# Altium schematic sheet SPI Stuff.SchDoc
size A4; SheetNumber: 5; SheetTotal: 6
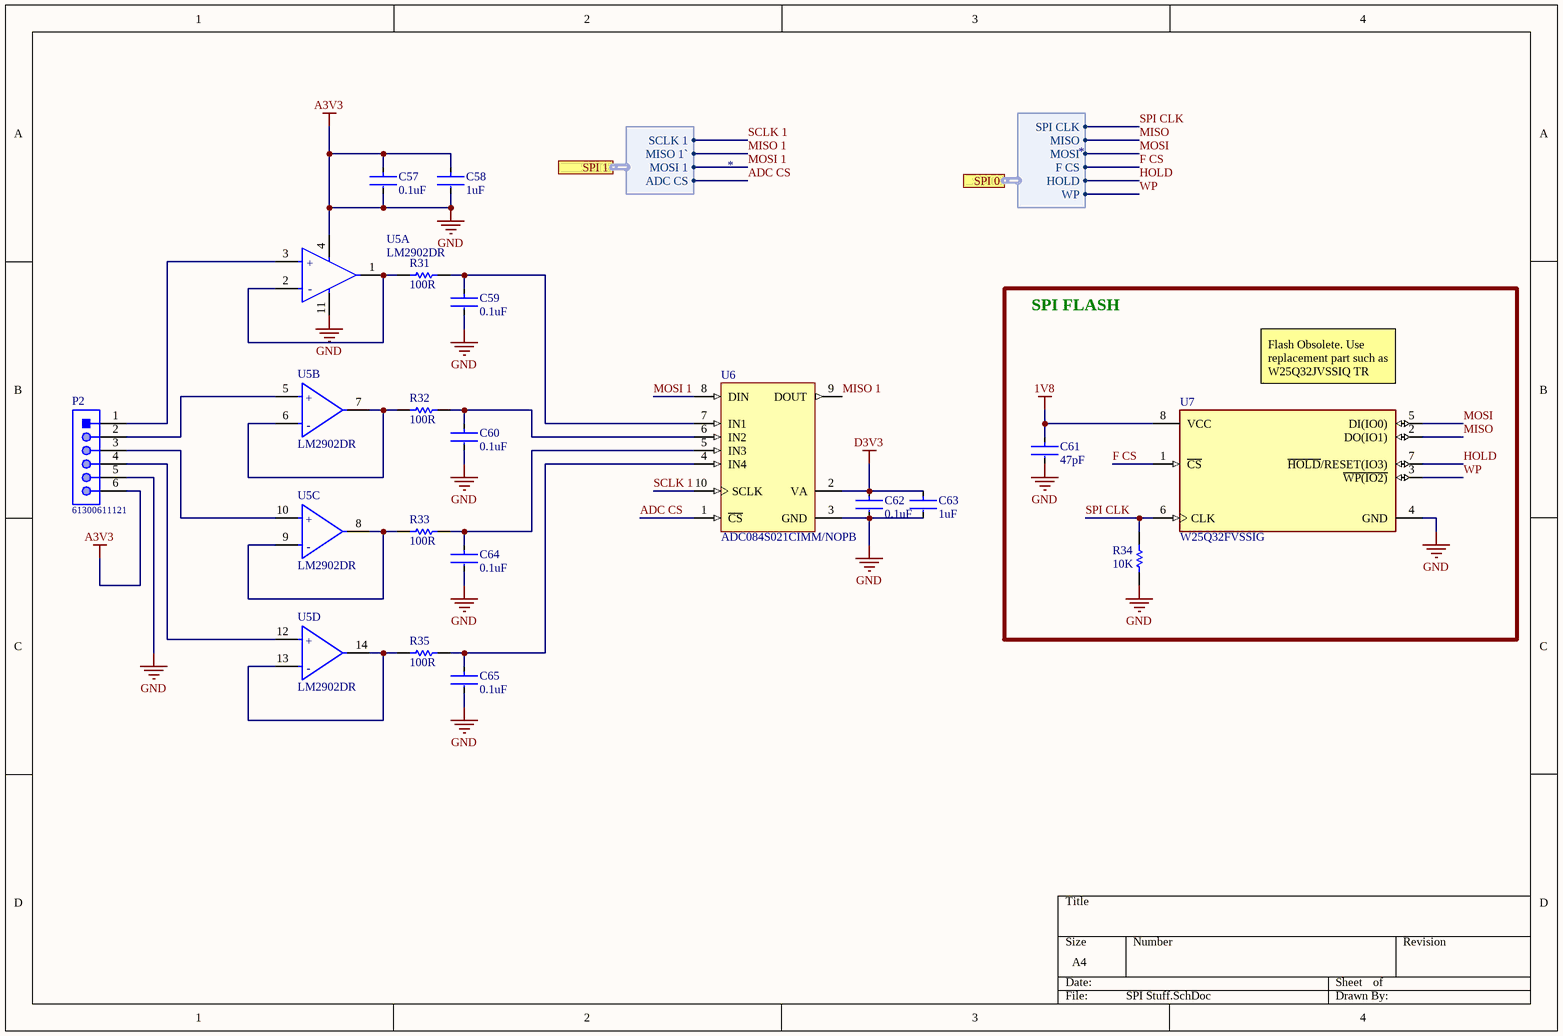
[diagram p0: SPI Stuff.SchDoc]

## Parts
C57  0.1uF  [FP-GRM15-MFG]
C58  1uF  [FP-GRM15-MFG]
C59  0.1uF  [FP-GRM15-MFG]
C60  0.1uF  [FP-GRM15-MFG]
C61  47pF  [FP-GRM15-MFG]
C62  0.1uF  [FP-GRM15-MFG]
C63  1uF  [FP-GRM15-MFG]
C64  0.1uF  [FP-GRM15-MFG]
C65  0.1uF  [FP-GRM15-MFG]
P2  61300611121  [61300611121]
R31  100R  [RESC1005X40X25LL05T05]
R32  100R  [RESC1005X40X25LL05T05]
R33  100R  [RESC1005X40X25LL05T05]
R34  10K  [RESC1005X40X25LL05T05]
R35  100R  [RESC1005X40X25LL05T05]
U5  LM2902DR  [FP-D0014A-IPC_A]  (parts A,B,C,D of 4)
U6  ADC084S021CIMM/NOPB  [MUB10A_N]
U7  W25Q32FVSSIG  [FP-SS-MFG]

## Blocks framed on the sheet
SPI FLASH: C61 R34 U7

## Ports
SPI 0 (harness *), SPI 1 (harness *)

## Harnesses
*: SPI CLK, MISO, MOSI, F CS, WP, HOLD
*: SCLK 1, MISO 1`, MOSI 1, ADC CS

## Nets
1V8: C61.2 U7.8(VCC)
A3V3: C57.1 C57.2 C58.1 C58.2 C59.1 C60.1 C61.1 C62.1 C63.1 C64.1 C65.1 P2.5 P2.6 R34.1 U5.4(VCC) U5.11(GND) U6.3(GND) U7.4(GND)  [also labelled GND]
D3V3: C62.2 C63.2 U6.2(VA)
ADC CS: U6.1(~{CS}) ; port SPI 1.ADC CS
F CS: U7.1(~{CS}) ; port SPI 0.F CS
HOLD: U7.7(~{HOLD}/RESET(IO3)) ; port SPI 0.HOLD
MISO: U7.2(DO(IO1)) ; port SPI 0.MISO
MISO 1: U6.9(DOUT) ; port SPI 1.MISO 1`
MOSI: U7.5(DI(IO0)) ; port SPI 0.MOSI
MOSI 1: U6.8(DIN) ; port SPI 1.MOSI 1
SCLK 1: U6.10(SCLK) ; port SPI 1.SCLK 1
SPI CLK: R34.2 U7.6(CLK) ; port SPI 0.SPI CLK
WP: U7.3(~{WP(IO2)}) ; port SPI 0.WP
NetC59_2: C59.2 R31.1 U6.7(IN1)
NetC60_2: C60.2 R32.1 U6.6(IN2)
NetC64_2: C64.2 R33.1 U6.5(IN3)
NetC65_2: C65.2 R35.1 U6.4(IN4)
NetP2_1: P2.1 U5.3(1IN+)
NetP2_2: P2.2 U5.5(2IN+)
NetP2_3: P2.3 U5.10(3IN+)
NetP2_4: P2.4 U5.12(4IN+)
NetR31_2: R31.2 U5.1(1OUT) U5.2(1IN-)
NetR32_2: R32.2 U5.6(2IN-) U5.7(2OUT)
NetR33_2: R33.2 U5.8(3OUT) U5.9(3IN-)
NetR35_2: R35.2 U5.13(4IN-) U5.14(4OUT)

## Notes on the sheet
- (near U7) Flash Obsolete. Use replacement part such as W25Q32JVSSIQ TR
- (in symbol CMP-04895-000441-1, part A) +; -
- (in symbol CMP-04895-000441-1, part B) +; -
- (in symbol CMP-04895-000441-1, part C) +; -
- (in symbol CMP-04895-000441-1, part D) +; -

## Library data of the parts
C57-C65 = CMP-2100-03641-2: CAP CER 0.1UF 16V X7R 0402; Manufacturer Part Number: GRM155R71C104KA88D; Manufacturer: Murata; Standoff Height: 0mm; Tolerance: 10%; Voltage Rating: 16Vdc; Material: Ceramic; Capacitance: 0.10μF; Value: 0.10μF; RoHS: TRUE; Temperature Characteristic: X7R; Octopart: https://octopart.com/grm155r71c104ka88d-murata-196880; Digikey Description: CAP CER 0.1UF 16V X7R 0402; Device Class L3: Ceramic Capacitors; Height: 0.55mm; ComponentLink2Description: Datasheet; Temperature Range Low: -55°C; Ipc Land Pattern Name: CAPC10050X219; ComponentLink2URL: https://search.murata.co.jp/Ceramy/image/img/A01X/G101/ENG/GRM155R71H471KA01-01A.pdf; Device Class L1: Passive Components; Lead Free: yes; Category: Cap; Package: GRM15; Temperature: -55°C to +125°C; Device Class L2: Capacitors; Temperature Range High: +125°C; Mouser Description: 0402 0.1 uF 16V ±10 % Tolerance X7R SMT Multilayer Ceramic Capacitor
P2 = CMP-1502-01070-1: THT Vertical Pin Header WR-PHD, Pitch 2.54 mm, Single Row, 6 pins; Manufacturer: Wurth Elektronik; Gender: Male; Pin Number: 6; Pitch: 2.54mm; Working Voltage: 250VAC; Rated Current: 3A; Withstanding Voltage: 500VAC; Contact Resistance: 20mOhm; Operating Temperature: -40to105degC; Packaging: Bag; Datasheet URL: https://katalog.we-online.de/em/datasheet/6130xx11121.pdf; Package Reference: 61300611121; Mounting Technology: THT; Publisher: WurthElektronik; Part Number: 61300611121; Manufacturer URL: http://www.we-online.de; Row Number: Single; Orientation: Vertical
R31-R35 = CMP-2000-07451-1: Chip Resistor, 0 Ohm, 0.1 W, -55 to 155 degC, 0402 (1005 Metric), RoHS, Tape and Reel; Manufacturer: Panasonic; Voltage Rating (DC): 50V; Temperature Coefficient: 600ppm/��C; Max Power Dissipation: 100mW; Resistance: 0mOhm; Tolerance: 5%; Number of Terminations: 2; Mount: SurfaceMount; Height: 0.35mm; Packaging: TapeandReel; Contact Plating: Tin; Manufacturer URL: http://www.panasonic.com/; Composition: ThickFilm; Max Operating Temperature: 155degC; REACH SVHC: NoSVHC; Case/Package: 0402; Package Reference: 402; Depth: 0.5mm; Package Description: 2-Pin Surface Mount Device, Body 1 x 0.5 mm; Datasheet URL: https://industrial.panasonic.com/cdbs/www-data/pdf/RDA0000/AOA0000C301.pdf; RoHSCompliant: True; Case Code (Imperial): 0402; Military Standard: Not; Min Operating Temperature: -55degC; Power Rating: 100mW; Datasheet Version: 03/2015; Length: 1mm; Case Code (Metric): 1005; Termination: SMD/SMT; Mounting Technology: SurfaceMount; Voltage Rating: 50V; Width: 0.02inch; Package Quantity: 1; Lead Free: LeadFree; Radiation Hardening: No
U5 = CMP-04895-000441-1: IC OPAMP GP 4 CIRCUIT 14SOIC; Dual Supply Voltage: 9V; Min Supply Voltage: 3V; Voltage Gain: 100dB; Number of Amplifiers: 4; Nominal Supply Current: 3mA; Min Dual Supply Voltage: 1.5V; Output Current: 30mA; Common Mode Rejection Ratio: 50dB; Output Current per Channel: 60mA; Input Offset Voltage (Vos): 7mV; Input Bias Current: 250nA; Max Dual Supply Voltage: 13V; Slew Rate: 0.5V/µs; Operating Supply Current: 1.4mA; Bandwidth: 1.2MHz; Max Supply Voltage: 26V; Radiation Hardening: No; Contact Plating: Tin; Mount: Surface Mount; Width: 3.91mm; Number of Elements: 4; Number of Circuits: 4; Height: 1.58mm; Min Operating Temperature: -40°C; Length: 8.65mm; Package Quantity: 1; Packaging: Tape and Reel; Lead Free: Lead Free; Case/Package: SOIC; Number of Channels: 4; Max Operating Temperature: 125°C; REACH SVHC: No SVHC; Operating Supply Voltage: 13V; Unity Gain Bandwidth Product: 1.2MHz; Number of Pins: 14; Gain Bandwidth Product: 1.2MHz; Power Supply Rejection Ratio (PSRR): 50dB
U6 = CMP-0054-00454-2: 4 Channel, 50 kSPS to 200 kSPS, 8-Bit A/D Converter, 10-pin Mini SOIC, Pb-Free; Manufacturer: National Semiconductor; PackageTopMarking: ZXTT*X19C; PowerWise: Y; CompType: ADC IC; ComponentLink3Description: MUB10A Package Page; ComponentLink1Description: ADC084S021 Datasheet; DatasheetVersion: Aug-2008; PackageVersion: revB, Jul-2003; ComponentLink2URL: http://www.national.com/pf/AD/ADC084S021.html; RevisionNote: Component URLs added; PinCount: 10; PackageDescription: Mini-SO, Molded, .118 x .118 x .034in Body, 10 Lead, .0197in Pitch; RoHS: Y; Code_JEDEC: MO-187-BA; PackageReference: MUB10A; ComponentLink3URL: http://www.national.com/packaging/folders/mub10a.html; ComponentLink2Description: ADC084S021 Web Page; ComponentLink1URL: http://www.national.com/ds/AD/ADC084S021.pdf
U7 = CMP-2000-05006-2: IC FLASH 32M SPI 104MHZ 8SOIC; Manufacturer: Winbond; Obsolete Part: true; Access Time: 7ns; Nominal Supply Current: 8-20mA; Memory Size: 32Mbits; Max Supply Voltage: 3.6V; Min Supply Voltage: 2.7V; Standoff Height: 0.05mm; Interface: SPI,Other; Package: SS; Memory Type: FLASH; Ipc Land Pattern Name: SOIC127P790X195-8; Temperature Range High: +85°C; Temperature: -40°C to +85°C; Octopart: https://octopart.com/w25q32fvssig-winbond-23896462; Manufacturer Part Number: W25Q32FVSSIG; Ambient Temperature Range Low: -40°C; Lead Free: Yes; Height: 2.16mm; Automotive: No; Device Class L2: Memory; Digikey Description: IC FLASH 32M SPI 104MHZ 8SOIC; RoHS: TRUE; Frequency: 104MHz; Ambient Temperature Range High: +85°C; ComponentLink2Description: Datasheet; Category: IC; Device Class L1: Integrated Circuits (ICs); Device Class L3: Flash; Temperature Range Low: -40°C; Footprint Url: http://www.winbond.com/resource-files/an0000009%20spiflash%20pcb%20layout%20guideline%20v2.0%2009252017.pdf?__locale=en; ComponentLink2URL: https://www.winbond.com/resource-files/w25q32fv%20revj%2006032016.pdf